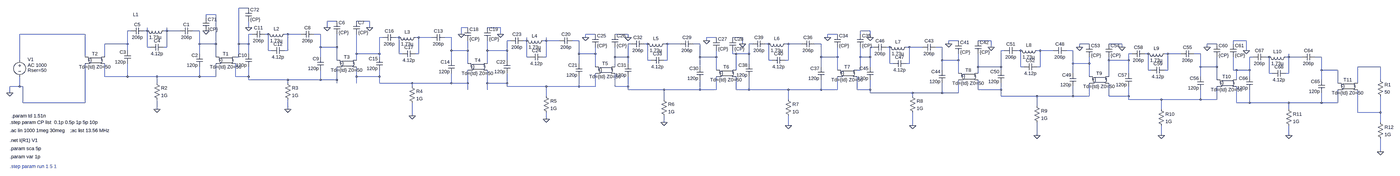
[diagram p0: schematic bridge_CPgroundcable.asc, whole sheet]
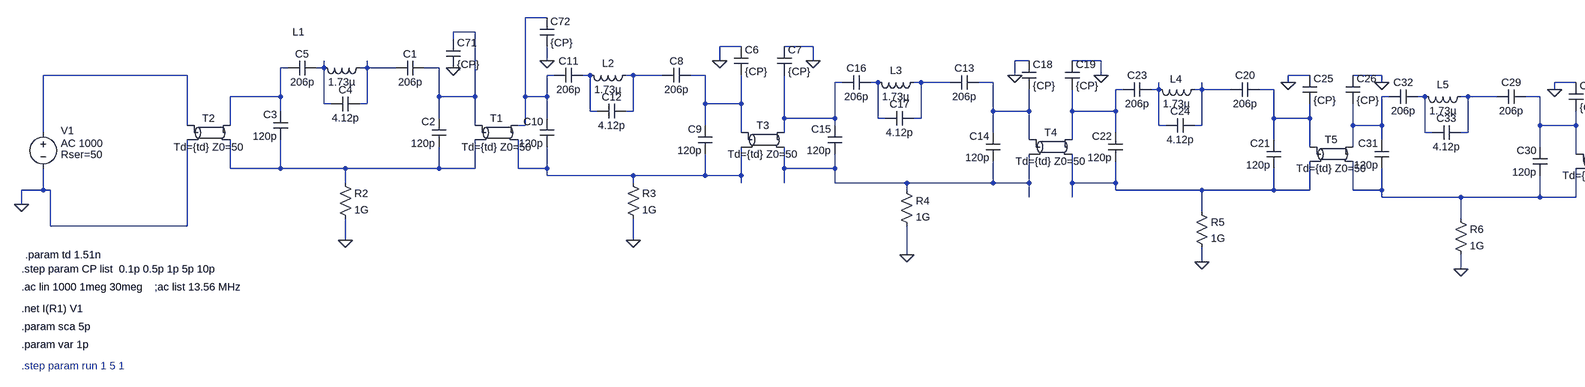
[diagram p1: schematic bridge_CPgroundcable.asc, part, row 1 of 1, column 1 of 2]
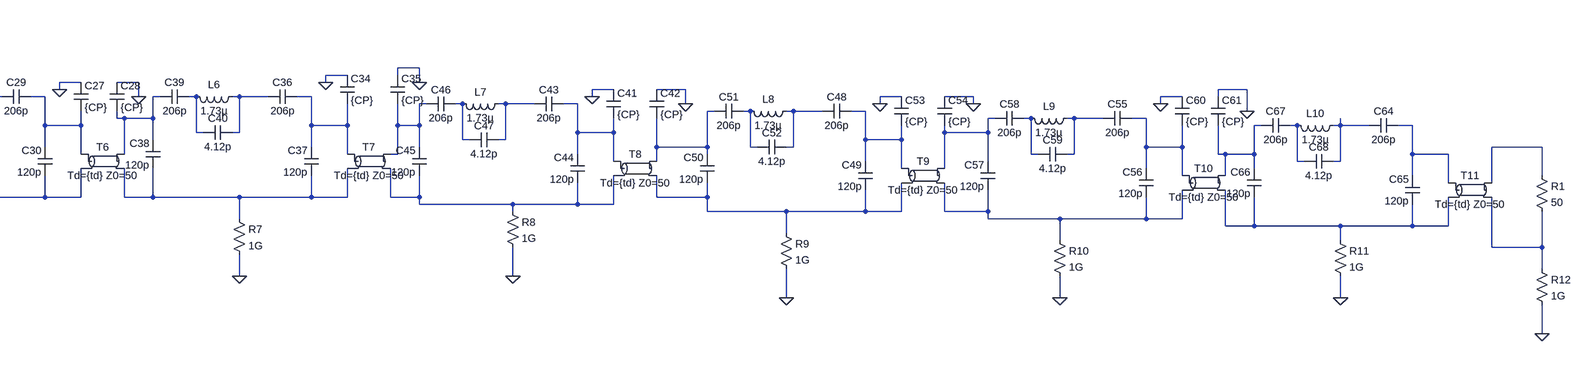
[diagram p2: schematic bridge_CPgroundcable.asc, part, row 1 of 1, column 2 of 2]
bridge_CPgroundcable.asc, the LTspice schematic file:
Version 4
SHEET 1 1680 680
WIRE -8640 -416 -8688 -416
WIRE -8800 -384 -8848 -384
WIRE -8848 -368 -8848 -384
WIRE -8208 -352 -8256 -352
WIRE -8048 -352 -8112 -352
WIRE -8640 -320 -8640 -352
WIRE -8256 -320 -8256 -352
WIRE -8048 -320 -8048 -352
WIRE -7568 -320 -7600 -320
WIRE -7408 -320 -7472 -320
WIRE -9216 -304 -9232 -304
WIRE -9136 -304 -9136 -320
WIRE -9136 -304 -9152 -304
WIRE -9040 -304 -9040 -320
WIRE -9040 -304 -9056 -304
WIRE -8976 -304 -9040 -304
WIRE -8880 -304 -8912 -304
WIRE -5600 -304 -5648 -304
WIRE -9440 -288 -9760 -288
WIRE -8624 -288 -8640 -288
WIRE -8544 -288 -8560 -288
WIRE -8448 -288 -8464 -288
WIRE -8384 -288 -8448 -288
WIRE -8288 -288 -8320 -288
WIRE -7600 -288 -7600 -320
WIRE -7408 -288 -7408 -320
WIRE -6944 -288 -6992 -288
WIRE -6784 -288 -6848 -288
WIRE -5760 -288 -5808 -288
WIRE -5648 -288 -5648 -304
WIRE -7984 -272 -8000 -272
WIRE -7904 -272 -7920 -272
WIRE -7808 -272 -7824 -272
WIRE -7744 -272 -7808 -272
WIRE -7648 -272 -7680 -272
WIRE -6992 -272 -6992 -288
WIRE -6784 -272 -6784 -288
WIRE -6352 -272 -6400 -272
WIRE -6224 -272 -6272 -272
WIRE -5808 -272 -5808 -288
WIRE -5600 -272 -5600 -304
WIRE -7360 -256 -7376 -256
WIRE -7280 -256 -7280 -272
WIRE -7280 -256 -7296 -256
WIRE -7184 -256 -7184 -272
WIRE -7184 -256 -7200 -256
WIRE -7120 -256 -7184 -256
WIRE -7024 -256 -7056 -256
WIRE -6400 -256 -6400 -272
WIRE -5168 -256 -5216 -256
WIRE -5008 -256 -5072 -256
WIRE -3760 -256 -3824 -256
WIRE -9232 -240 -9232 -304
WIRE -9232 -240 -9344 -240
WIRE -8880 -240 -8880 -304
WIRE -8800 -240 -8800 -384
WIRE -8800 -240 -8880 -240
WIRE -8688 -240 -8688 -416
WIRE -8640 -240 -8640 -288
WIRE -8640 -240 -8688 -240
WIRE -6768 -240 -6784 -240
WIRE -6688 -240 -6704 -240
WIRE -6592 -240 -6608 -240
WIRE -6528 -240 -6592 -240
WIRE -6432 -240 -6464 -240
WIRE -6224 -240 -6224 -272
WIRE -6176 -240 -6192 -240
WIRE -6096 -240 -6112 -240
WIRE -6000 -240 -6016 -240
WIRE -5936 -240 -6000 -240
WIRE -5840 -240 -5872 -240
WIRE -5216 -240 -5216 -256
WIRE -4528 -240 -4576 -240
WIRE -4368 -240 -4432 -240
WIRE -3904 -240 -3952 -240
WIRE -3824 -240 -3824 -256
WIRE -9136 -224 -9136 -304
WIRE -9120 -224 -9136 -224
WIRE -9040 -224 -9040 -304
WIRE -9040 -224 -9056 -224
WIRE -8288 -224 -8288 -288
WIRE -8208 -224 -8208 -288
WIRE -8208 -224 -8288 -224
WIRE -5584 -224 -5600 -224
WIRE -5504 -224 -5520 -224
WIRE -5408 -224 -5424 -224
WIRE -5344 -224 -5408 -224
WIRE -5248 -224 -5280 -224
WIRE -5008 -224 -5008 -256
WIRE -4576 -224 -4576 -240
WIRE -4368 -224 -4368 -240
WIRE -3952 -224 -3952 -240
WIRE -9232 -208 -9232 -240
WIRE -8544 -208 -8544 -288
WIRE -8528 -208 -8544 -208
WIRE -8448 -208 -8448 -288
WIRE -8448 -208 -8464 -208
WIRE -7648 -208 -7648 -272
WIRE -7568 -208 -7568 -256
WIRE -7568 -208 -7648 -208
WIRE -7472 -208 -7472 -256
WIRE -7376 -208 -7376 -256
WIRE -7376 -208 -7472 -208
WIRE -4944 -208 -4960 -208
WIRE -4864 -208 -4880 -208
WIRE -4768 -208 -4784 -208
WIRE -4704 -208 -4768 -208
WIRE -4608 -208 -4640 -208
WIRE -3760 -208 -3760 -256
WIRE -8880 -192 -8880 -240
WIRE -8640 -192 -8640 -240
WIRE -8112 -192 -8112 -288
WIRE -8000 -192 -8000 -272
WIRE -8000 -192 -8112 -192
WIRE -7904 -192 -7904 -272
WIRE -7888 -192 -7904 -192
WIRE -7808 -192 -7808 -272
WIRE -7808 -192 -7824 -192
WIRE -7024 -192 -7024 -256
WIRE -6944 -192 -6944 -224
WIRE -6944 -192 -7024 -192
WIRE -6272 -192 -6272 -208
WIRE -6256 -192 -6272 -192
WIRE -6192 -192 -6192 -240
WIRE -6192 -192 -6256 -192
WIRE -4320 -192 -4336 -192
WIRE -4240 -192 -4256 -192
WIRE -4144 -192 -4160 -192
WIRE -4080 -192 -4144 -192
WIRE -3984 -192 -4016 -192
WIRE -9440 -176 -9440 -288
WIRE -9344 -176 -9344 -240
WIRE -8800 -176 -8800 -240
WIRE -8688 -176 -8688 -240
WIRE -8688 -176 -8704 -176
WIRE -8288 -176 -8288 -224
WIRE -8000 -176 -8000 -192
WIRE -7280 -176 -7280 -256
WIRE -7264 -176 -7280 -176
WIRE -7184 -176 -7184 -256
WIRE -7184 -176 -7200 -176
WIRE -6848 -176 -6848 -224
WIRE -6784 -176 -6784 -240
WIRE -6784 -176 -6848 -176
WIRE -6432 -176 -6432 -240
WIRE -6352 -176 -6352 -208
WIRE -6352 -176 -6432 -176
WIRE -5840 -176 -5840 -240
WIRE -5760 -176 -5760 -224
WIRE -5760 -176 -5840 -176
WIRE -5648 -176 -5648 -224
WIRE -5600 -176 -5600 -224
WIRE -5600 -176 -5648 -176
WIRE -3728 -176 -3744 -176
WIRE -3648 -176 -3664 -176
WIRE -3552 -176 -3552 -192
WIRE -3552 -176 -3568 -176
WIRE -3488 -176 -3552 -176
WIRE -3392 -176 -3424 -176
WIRE -9760 -160 -9760 -288
WIRE -8208 -160 -8208 -224
WIRE -8112 -160 -8112 -192
WIRE -7648 -160 -7648 -208
WIRE -7376 -160 -7376 -208
WIRE -6688 -160 -6688 -240
WIRE -6672 -160 -6688 -160
WIRE -6592 -160 -6592 -240
WIRE -6592 -160 -6608 -160
WIRE -6096 -160 -6096 -240
WIRE -6080 -160 -6096 -160
WIRE -6000 -160 -6000 -240
WIRE -6000 -160 -6016 -160
WIRE -5248 -160 -5248 -224
WIRE -5168 -160 -5168 -192
WIRE -5168 -160 -5248 -160
WIRE -4432 -160 -4432 -176
WIRE -4336 -160 -4336 -192
WIRE -4336 -160 -4432 -160
WIRE -7568 -144 -7568 -208
WIRE -7472 -144 -7472 -208
WIRE -7024 -144 -7024 -192
WIRE -6784 -144 -6784 -176
WIRE -6192 -144 -6192 -192
WIRE -5504 -144 -5504 -224
WIRE -5488 -144 -5504 -144
WIRE -5408 -144 -5408 -224
WIRE -5408 -144 -5424 -144
WIRE -4608 -144 -4608 -208
WIRE -4528 -144 -4528 -176
WIRE -4528 -144 -4608 -144
WIRE -6944 -128 -6944 -192
WIRE -6848 -128 -6848 -176
WIRE -6432 -128 -6432 -176
WIRE -5840 -128 -5840 -176
WIRE -5600 -128 -5600 -176
WIRE -5072 -128 -5072 -192
WIRE -4960 -128 -4960 -208
WIRE -4960 -128 -5072 -128
WIRE -4864 -128 -4864 -208
WIRE -4848 -128 -4864 -128
WIRE -4768 -128 -4768 -208
WIRE -4768 -128 -4784 -128
WIRE -3984 -128 -3984 -192
WIRE -3904 -128 -3904 -176
WIRE -3904 -128 -3984 -128
WIRE -3104 -128 -3216 -128
WIRE -6352 -112 -6352 -176
WIRE -6256 -112 -6256 -192
WIRE -5760 -112 -5760 -176
WIRE -5648 -112 -5648 -176
WIRE -5648 -112 -5664 -112
WIRE -5248 -112 -5248 -160
WIRE -4960 -112 -4960 -128
WIRE -4240 -112 -4240 -192
WIRE -4224 -112 -4240 -112
WIRE -4144 -112 -4144 -192
WIRE -4144 -112 -4160 -112
WIRE -3824 -112 -3824 -176
WIRE -3808 -112 -3824 -112
WIRE -3744 -112 -3744 -176
WIRE -3744 -112 -3808 -112
WIRE -3392 -112 -3392 -176
WIRE -3312 -112 -3392 -112
WIRE -5168 -96 -5168 -160
WIRE -5072 -96 -5072 -128
WIRE -4608 -96 -4608 -144
WIRE -4336 -96 -4336 -160
WIRE -3648 -96 -3648 -176
WIRE -3632 -96 -3648 -96
WIRE -3552 -96 -3552 -176
WIRE -3552 -96 -3568 -96
WIRE -9344 -80 -9344 -144
WIRE -9232 -80 -9232 -144
WIRE -9232 -80 -9344 -80
WIRE -9088 -80 -9232 -80
WIRE -8880 -80 -8880 -128
WIRE -8880 -80 -9088 -80
WIRE -8800 -80 -8800 -144
WIRE -8800 -80 -8880 -80
WIRE -8704 -80 -8704 -144
WIRE -8640 -80 -8640 -128
WIRE -8640 -80 -8704 -80
WIRE -8112 -80 -8112 -128
WIRE -8000 -80 -8000 -112
WIRE -8000 -80 -8112 -80
WIRE -4528 -80 -4528 -144
WIRE -4432 -80 -4432 -160
WIRE -3984 -80 -3984 -128
WIRE -3744 -80 -3744 -112
WIRE -8640 -64 -8640 -80
WIRE -8448 -64 -8640 -64
WIRE -8288 -64 -8288 -112
WIRE -8288 -64 -8448 -64
WIRE -8208 -64 -8208 -128
WIRE -8208 -64 -8288 -64
WIRE -3904 -64 -3904 -128
WIRE -3808 -64 -3808 -112
WIRE -3392 -64 -3392 -112
WIRE -3104 -64 -3104 -128
WIRE -9088 -48 -9088 -80
WIRE -8448 -48 -8448 -64
WIRE -8208 -48 -8208 -64
WIRE -8112 -48 -8112 -80
WIRE -8000 -48 -8000 -80
WIRE -7840 -48 -8000 -48
WIRE -7648 -48 -7648 -96
WIRE -7648 -48 -7840 -48
WIRE -7568 -48 -7568 -112
WIRE -7568 -48 -7648 -48
WIRE -7472 -48 -7472 -112
WIRE -7376 -48 -7376 -96
WIRE -7376 -48 -7472 -48
WIRE -3312 -48 -3312 -112
WIRE -3216 -48 -3216 -128
WIRE -9760 -32 -9760 -80
WIRE -9760 -32 -9808 -32
WIRE -9744 -32 -9760 -32
WIRE -7840 -32 -7840 -48
WIRE -7376 -32 -7376 -48
WIRE -7184 -32 -7376 -32
WIRE -7024 -32 -7024 -80
WIRE -7024 -32 -7184 -32
WIRE -6944 -32 -6944 -96
WIRE -6944 -32 -7024 -32
WIRE -6848 -32 -6848 -96
WIRE -6784 -32 -6784 -80
WIRE -6784 -32 -6848 -32
WIRE -7568 -16 -7568 -48
WIRE -7472 -16 -7472 -48
WIRE -6784 -16 -6784 -32
WIRE -6608 -16 -6784 -16
WIRE -6432 -16 -6432 -64
WIRE -6432 -16 -6608 -16
WIRE -6352 -16 -6352 -80
WIRE -6352 -16 -6432 -16
WIRE -6256 -16 -6256 -80
WIRE -6192 -16 -6192 -80
WIRE -6192 -16 -6256 -16
WIRE -6000 -16 -6192 -16
WIRE -5840 -16 -5840 -64
WIRE -5840 -16 -6000 -16
WIRE -5760 -16 -5760 -80
WIRE -5760 -16 -5840 -16
WIRE -5664 -16 -5664 -80
WIRE -5600 -16 -5600 -64
WIRE -5600 -16 -5664 -16
WIRE -5072 -16 -5072 -64
WIRE -4960 -16 -4960 -48
WIRE -4960 -16 -5072 -16
WIRE -9808 0 -9808 -32
WIRE -5600 0 -5600 -16
WIRE -5392 0 -5600 0
WIRE -5248 0 -5248 -48
WIRE -5248 0 -5392 0
WIRE -5168 0 -5168 -64
WIRE -5168 0 -5248 0
WIRE -7184 16 -7184 -32
WIRE -5392 16 -5392 0
WIRE -4960 16 -4960 -16
WIRE -4784 16 -4960 16
WIRE -4608 16 -4608 -32
WIRE -4608 16 -4784 16
WIRE -4528 16 -4528 -48
WIRE -4528 16 -4608 16
WIRE -4432 16 -4432 -48
WIRE -4336 16 -4336 -32
WIRE -4336 16 -4432 16
WIRE -6608 32 -6608 -16
WIRE -6000 32 -6000 -16
WIRE -4336 32 -4336 16
WIRE -4176 32 -4336 32
WIRE -3984 32 -3984 -16
WIRE -3984 32 -4176 32
WIRE -3904 32 -3904 -32
WIRE -3904 32 -3984 32
WIRE -9744 48 -9744 -32
WIRE -9440 48 -9440 -144
WIRE -9440 48 -9744 48
WIRE -3808 48 -3808 -32
WIRE -3744 48 -3744 -16
WIRE -3744 48 -3808 48
WIRE -3552 48 -3744 48
WIRE -3392 48 -3392 0
WIRE -3392 48 -3552 48
WIRE -3312 48 -3312 -16
WIRE -3312 48 -3392 48
WIRE -4784 64 -4784 16
WIRE -9088 80 -9088 32
WIRE -8448 80 -8448 32
WIRE -4176 80 -4176 32
WIRE -3552 80 -3552 48
WIRE -3216 96 -3216 -16
WIRE -3104 96 -3104 16
WIRE -3104 96 -3216 96
WIRE -7840 112 -7840 48
WIRE -7184 128 -7184 96
WIRE -6608 144 -6608 112
WIRE -3104 144 -3104 96
WIRE -6000 160 -6000 112
WIRE -5392 160 -5392 96
WIRE -4784 208 -4784 144
WIRE -4176 208 -4176 160
WIRE -3552 208 -3552 160
WIRE -3104 288 -3104 224
FLAG -9808 0 0
FLAG -3104 288 0
FLAG -8848 -304 0
FLAG -8640 -320 0
FLAG -8256 -320 0
FLAG -8048 -320 0
FLAG -6400 -256 0
FLAG -6224 -240 0
FLAG -5808 -272 0
FLAG -5600 -272 0
FLAG -5216 -240 0
FLAG -5008 -224 0
FLAG -4576 -224 0
FLAG -4368 -224 0
FLAG -3952 -224 0
FLAG -3760 -208 0
FLAG -7600 -288 0
FLAG -7408 -288 0
FLAG -6992 -272 0
FLAG -6784 -272 0
FLAG -3552 208 0
FLAG -4176 208 0
FLAG -4784 208 0
FLAG -5392 160 0
FLAG -6000 160 0
FLAG -6608 144 0
FLAG -7184 128 0
FLAG -7840 112 0
FLAG -8448 80 0
FLAG -9088 80 0
SYMBOL voltage -9760 -176 R0
WINDOW 0 39 12 Left 2
WINDOW 123 39 40 Left 2
WINDOW 39 39 65 Left 2
SYMATTR InstName V1
SYMATTR Value2 AC 1000
SYMATTR SpiceLine Rser=50
SYMATTR Value ""
SYMBOL res -3120 -80 R0
SYMATTR InstName R1
SYMATTR Value 50
SYMBOL tline -8752 -160 R0
SYMATTR InstName T1
SYMATTR Value Td={td} Z0=50
SYMBOL tline -9392 -160 R0
SYMATTR InstName T2
SYMATTR Value Td={td} Z0=50
SYMBOL cap -8912 -320 R90
WINDOW 0 0 32 VBottom 2
WINDOW 3 32 32 VTop 2
SYMATTR InstName C1
SYMATTR Value 206p
SYMBOL cap -8864 -128 R180
WINDOW 0 24 56 Left 2
WINDOW 3 24 8 Left 2
SYMATTR InstName C2
SYMATTR Value 120p
SYMBOL cap -9216 -144 R180
WINDOW 0 24 56 Left 2
WINDOW 3 24 8 Left 2
SYMATTR InstName C3
SYMATTR Value 120p
SYMBOL ind -9040 -320 R90
WINDOW 0 -49 152 VBottom 2
WINDOW 3 32 56 VTop 2
SYMATTR InstName L1
SYMATTR Value 1.73µ
SYMBOL cap -9152 -320 R90
WINDOW 0 0 32 VBottom 2
WINDOW 3 32 32 VTop 2
SYMATTR InstName C5
SYMATTR Value 206p
SYMBOL cap -9056 -240 R90
WINDOW 0 0 32 VBottom 2
WINDOW 3 32 32 VTop 2
SYMATTR InstName C4
SYMATTR Value 4.12p
SYMBOL tline -8160 -144 R0
SYMATTR InstName T3
SYMATTR Value Td={td} Z0=50
SYMBOL cap -8320 -304 R90
WINDOW 0 0 32 VBottom 2
WINDOW 3 32 32 VTop 2
SYMATTR InstName C8
SYMATTR Value 206p
SYMBOL cap -8272 -112 R180
WINDOW 0 24 56 Left 2
WINDOW 3 24 8 Left 2
SYMATTR InstName C9
SYMATTR Value 120p
SYMBOL cap -8624 -128 R180
WINDOW 0 24 56 Left 2
WINDOW 3 24 8 Left 2
SYMATTR InstName C10
SYMATTR Value 120p
SYMBOL ind -8448 -304 R90
WINDOW 0 5 56 VBottom 2
WINDOW 3 32 56 VTop 2
SYMATTR InstName L2
SYMATTR Value 1.73µ
SYMBOL cap -8560 -304 R90
WINDOW 0 0 32 VBottom 2
WINDOW 3 32 32 VTop 2
SYMATTR InstName C11
SYMATTR Value 206p
SYMBOL cap -8464 -224 R90
WINDOW 0 0 32 VBottom 2
WINDOW 3 32 32 VTop 2
SYMATTR InstName C12
SYMATTR Value 4.12p
SYMBOL tline -7520 -128 R0
SYMATTR InstName T4
SYMATTR Value Td={td} Z0=50
SYMBOL cap -7680 -288 R90
WINDOW 0 0 32 VBottom 2
WINDOW 3 32 32 VTop 2
SYMATTR InstName C13
SYMATTR Value 206p
SYMBOL cap -7632 -96 R180
WINDOW 0 24 56 Left 2
WINDOW 3 24 8 Left 2
SYMATTR InstName C14
SYMATTR Value 120p
SYMBOL cap -7984 -112 R180
WINDOW 0 24 56 Left 2
WINDOW 3 24 8 Left 2
SYMATTR InstName C15
SYMATTR Value 120p
SYMBOL ind -7808 -288 R90
WINDOW 0 5 56 VBottom 2
WINDOW 3 32 56 VTop 2
SYMATTR InstName L3
SYMATTR Value 1.73µ
SYMBOL cap -7920 -288 R90
WINDOW 0 0 32 VBottom 2
WINDOW 3 32 32 VTop 2
SYMATTR InstName C16
SYMATTR Value 206p
SYMBOL cap -7824 -208 R90
WINDOW 0 0 32 VBottom 2
WINDOW 3 32 32 VTop 2
SYMATTR InstName C17
SYMATTR Value 4.12p
SYMBOL tline -6896 -112 R0
SYMATTR InstName T5
SYMATTR Value Td={td} Z0=50
SYMBOL cap -7056 -272 R90
WINDOW 0 0 32 VBottom 2
WINDOW 3 32 32 VTop 2
SYMATTR InstName C20
SYMATTR Value 206p
SYMBOL cap -7008 -80 R180
WINDOW 0 24 56 Left 2
WINDOW 3 24 8 Left 2
SYMATTR InstName C21
SYMATTR Value 120p
SYMBOL cap -7360 -96 R180
WINDOW 0 24 56 Left 2
WINDOW 3 24 8 Left 2
SYMATTR InstName C22
SYMATTR Value 120p
SYMBOL ind -7184 -272 R90
WINDOW 0 8 57 VBottom 2
WINDOW 3 32 56 VTop 2
SYMATTR InstName L4
SYMATTR Value 1.73µ
SYMBOL cap -7296 -272 R90
WINDOW 0 0 32 VBottom 2
WINDOW 3 32 32 VTop 2
SYMATTR InstName C23
SYMATTR Value 206p
SYMBOL cap -7200 -192 R90
WINDOW 0 0 32 VBottom 2
WINDOW 3 32 32 VTop 2
SYMATTR InstName C24
SYMATTR Value 4.12p
SYMBOL tline -6304 -96 R0
SYMATTR InstName T6
SYMATTR Value Td={td} Z0=50
SYMBOL cap -6464 -256 R90
WINDOW 0 0 32 VBottom 2
WINDOW 3 32 32 VTop 2
SYMATTR InstName C29
SYMATTR Value 206p
SYMBOL cap -6416 -64 R180
WINDOW 0 24 56 Left 2
WINDOW 3 24 8 Left 2
SYMATTR InstName C30
SYMATTR Value 120p
SYMBOL cap -6768 -80 R180
WINDOW 0 24 56 Left 2
WINDOW 3 24 8 Left 2
SYMATTR InstName C31
SYMATTR Value 120p
SYMBOL ind -6592 -256 R90
WINDOW 0 5 56 VBottom 2
WINDOW 3 32 56 VTop 2
SYMATTR InstName L5
SYMATTR Value 1.73µ
SYMBOL cap -6704 -256 R90
WINDOW 0 0 32 VBottom 2
WINDOW 3 32 32 VTop 2
SYMATTR InstName C32
SYMATTR Value 206p
SYMBOL cap -6608 -176 R90
WINDOW 0 0 32 VBottom 2
WINDOW 3 32 32 VTop 2
SYMATTR InstName C33
SYMATTR Value 4.12p
SYMBOL tline -5712 -96 R0
SYMATTR InstName T7
SYMATTR Value Td={td} Z0=50
SYMBOL cap -5872 -256 R90
WINDOW 0 0 32 VBottom 2
WINDOW 3 32 32 VTop 2
SYMATTR InstName C36
SYMATTR Value 206p
SYMBOL cap -5824 -64 R180
WINDOW 0 24 56 Left 2
WINDOW 3 24 8 Left 2
SYMATTR InstName C37
SYMATTR Value 120p
SYMBOL cap -6176 -80 R180
WINDOW 0 24 56 Left 2
WINDOW 3 24 8 Left 2
SYMATTR InstName C38
SYMATTR Value 120p
SYMBOL ind -6000 -256 R90
WINDOW 0 5 56 VBottom 2
WINDOW 3 32 56 VTop 2
SYMATTR InstName L6
SYMATTR Value 1.73µ
SYMBOL cap -6112 -256 R90
WINDOW 0 0 32 VBottom 2
WINDOW 3 32 32 VTop 2
SYMATTR InstName C39
SYMATTR Value 206p
SYMBOL cap -6016 -176 R90
WINDOW 0 0 32 VBottom 2
WINDOW 3 32 32 VTop 2
SYMATTR InstName C40
SYMATTR Value 4.12p
SYMBOL tline -5120 -80 R0
SYMATTR InstName T8
SYMATTR Value Td={td} Z0=50
SYMBOL cap -5280 -240 R90
WINDOW 0 0 32 VBottom 2
WINDOW 3 32 32 VTop 2
SYMATTR InstName C43
SYMATTR Value 206p
SYMBOL cap -5232 -48 R180
WINDOW 0 24 56 Left 2
WINDOW 3 24 8 Left 2
SYMATTR InstName C44
SYMATTR Value 120p
SYMBOL cap -5584 -64 R180
WINDOW 0 24 56 Left 2
WINDOW 3 24 8 Left 2
SYMATTR InstName C45
SYMATTR Value 120p
SYMBOL ind -5408 -240 R90
WINDOW 0 5 56 VBottom 2
WINDOW 3 32 56 VTop 2
SYMATTR InstName L7
SYMATTR Value 1.73µ
SYMBOL cap -5520 -240 R90
WINDOW 0 0 32 VBottom 2
WINDOW 3 32 32 VTop 2
SYMATTR InstName C46
SYMATTR Value 206p
SYMBOL cap -5424 -160 R90
WINDOW 0 0 32 VBottom 2
WINDOW 3 32 32 VTop 2
SYMATTR InstName C47
SYMATTR Value 4.12p
SYMBOL tline -4480 -64 R0
SYMATTR InstName T9
SYMATTR Value Td={td} Z0=50
SYMBOL cap -4640 -224 R90
WINDOW 0 0 32 VBottom 2
WINDOW 3 32 32 VTop 2
SYMATTR InstName C48
SYMATTR Value 206p
SYMBOL cap -4592 -32 R180
WINDOW 0 24 56 Left 2
WINDOW 3 24 8 Left 2
SYMATTR InstName C49
SYMATTR Value 120p
SYMBOL cap -4944 -48 R180
WINDOW 0 24 56 Left 2
WINDOW 3 24 8 Left 2
SYMATTR InstName C50
SYMATTR Value 120p
SYMBOL ind -4768 -224 R90
WINDOW 0 5 56 VBottom 2
WINDOW 3 32 56 VTop 2
SYMATTR InstName L8
SYMATTR Value 1.73µ
SYMBOL cap -4880 -224 R90
WINDOW 0 0 32 VBottom 2
WINDOW 3 32 32 VTop 2
SYMATTR InstName C51
SYMATTR Value 206p
SYMBOL cap -4784 -144 R90
WINDOW 0 0 32 VBottom 2
WINDOW 3 32 32 VTop 2
SYMATTR InstName C52
SYMATTR Value 4.12p
SYMBOL tline -3856 -48 R0
SYMATTR InstName T10
SYMATTR Value Td={td} Z0=50
SYMBOL cap -4016 -208 R90
WINDOW 0 0 32 VBottom 2
WINDOW 3 32 32 VTop 2
SYMATTR InstName C55
SYMATTR Value 206p
SYMBOL cap -3968 -16 R180
WINDOW 0 24 56 Left 2
WINDOW 3 24 8 Left 2
SYMATTR InstName C56
SYMATTR Value 120p
SYMBOL cap -4320 -32 R180
WINDOW 0 24 56 Left 2
WINDOW 3 24 8 Left 2
SYMATTR InstName C57
SYMATTR Value 120p
SYMBOL ind -4144 -208 R90
WINDOW 0 5 56 VBottom 2
WINDOW 3 32 56 VTop 2
SYMATTR InstName L9
SYMATTR Value 1.73µ
SYMBOL cap -4256 -208 R90
WINDOW 0 0 32 VBottom 2
WINDOW 3 32 32 VTop 2
SYMATTR InstName C58
SYMATTR Value 206p
SYMBOL cap -4160 -128 R90
WINDOW 0 0 32 VBottom 2
WINDOW 3 32 32 VTop 2
SYMATTR InstName C59
SYMATTR Value 4.12p
SYMBOL tline -3264 -32 R0
SYMATTR InstName T11
SYMATTR Value Td={td} Z0=50
SYMBOL cap -3424 -192 R90
WINDOW 0 0 32 VBottom 2
WINDOW 3 32 32 VTop 2
SYMATTR InstName C64
SYMATTR Value 206p
SYMBOL cap -3376 0 R180
WINDOW 0 24 56 Left 2
WINDOW 3 24 8 Left 2
SYMATTR InstName C65
SYMATTR Value 120p
SYMBOL cap -3728 -16 R180
WINDOW 0 24 56 Left 2
WINDOW 3 24 8 Left 2
SYMATTR InstName C66
SYMATTR Value 120p
SYMBOL ind -3552 -192 R90
WINDOW 0 5 56 VBottom 2
WINDOW 3 32 56 VTop 2
SYMATTR InstName L10
SYMATTR Value 1.73µ
SYMBOL cap -3664 -192 R90
WINDOW 0 0 32 VBottom 2
WINDOW 3 32 32 VTop 2
SYMATTR InstName C67
SYMATTR Value 206p
SYMBOL cap -3568 -112 R90
WINDOW 0 0 32 VBottom 2
WINDOW 3 32 32 VTop 2
SYMATTR InstName C68
SYMATTR Value 4.12p
SYMBOL res -3120 128 R0
SYMATTR InstName R12
SYMATTR Value 1G
SYMBOL cap -8864 -368 R0
SYMATTR InstName C71
SYMATTR Value {CP}
SYMBOL cap -8656 -416 R0
SYMATTR InstName C72
SYMATTR Value {CP}
SYMBOL cap -8224 -352 R0
SYMATTR InstName C6
SYMATTR Value {CP}
SYMBOL cap -8128 -352 R0
SYMATTR InstName C7
SYMATTR Value {CP}
SYMBOL cap -7584 -320 R0
SYMATTR InstName C18
SYMATTR Value {CP}
SYMBOL cap -7488 -320 R0
SYMATTR InstName C19
SYMATTR Value {CP}
SYMBOL cap -6960 -288 R0
SYMATTR InstName C25
SYMATTR Value {CP}
SYMBOL cap -6864 -288 R0
SYMATTR InstName C26
SYMATTR Value {CP}
SYMBOL cap -6368 -272 R0
SYMATTR InstName C27
SYMATTR Value {CP}
SYMBOL cap -6288 -272 R0
SYMATTR InstName C28
SYMATTR Value {CP}
SYMBOL cap -5776 -288 R0
SYMATTR InstName C34
SYMATTR Value {CP}
SYMBOL cap -5664 -288 R0
SYMATTR InstName C35
SYMATTR Value {CP}
SYMBOL cap -5184 -256 R0
SYMATTR InstName C41
SYMATTR Value {CP}
SYMBOL cap -5088 -256 R0
SYMATTR InstName C42
SYMATTR Value {CP}
SYMBOL cap -4544 -240 R0
SYMATTR InstName C53
SYMATTR Value {CP}
SYMBOL cap -4448 -240 R0
SYMATTR InstName C54
SYMATTR Value {CP}
SYMBOL cap -3920 -240 R0
SYMATTR InstName C60
SYMATTR Value {CP}
SYMBOL cap -3840 -240 R0
SYMATTR InstName C61
SYMATTR Value {CP}
SYMBOL res -9104 -64 R0
SYMATTR InstName R2
SYMATTR Value 1G
SYMBOL res -8464 -64 R0
SYMATTR InstName R3
SYMATTR Value 1G
SYMBOL res -7856 -48 R0
SYMATTR InstName R4
SYMATTR Value 1G
SYMBOL res -7200 0 R0
SYMATTR InstName R5
SYMATTR Value 1G
SYMBOL res -6624 16 R0
SYMATTR InstName R6
SYMATTR Value 1G
SYMBOL res -6016 16 R0
SYMATTR InstName R7
SYMATTR Value 1G
SYMBOL res -5408 0 R0
SYMATTR InstName R8
SYMATTR Value 1G
SYMBOL res -4800 48 R0
SYMATTR InstName R9
SYMATTR Value 1G
SYMBOL res -4192 64 R0
SYMATTR InstName R10
SYMATTR Value 1G
SYMBOL res -3568 64 R0
SYMATTR InstName R11
SYMATTR Value 1G
TEXT -9808 184 Left 2 !.ac lin 1000 1meg 30meg
TEXT -9808 232 Left 2 !.net I(R1) V1
TEXT -9808 144 Left 2 !.step param CP list  0.1p 0.5p 1p 5p 10p
TEXT -9800 112 Left 2 !.param td 1.51n
TEXT -9808 272 Left 2 !.param sca 5p
TEXT -9808 312 Left 2 !.param var 1p
TEXT -9808 360 Left 2 ;.step param run 1 5 1
TEXT -9512 184 Left 2 !;ac list 13.56 MHz

The netlist it stands for:
* bridge_CPgroundcable.asc
V1 N006 0 AC 1000 Rser=50
R1 N042 N053 50
T1 N002 N043 N001 N044 Td={td} Z0=50
T2 N006 0 N003 N043 Td={td} Z0=50
C1 N002 N005 206p
C2 N043 N002 120p
C3 N043 N003 120p
L1 N005 N004 1.73µ
C5 N004 N003 206p
C4 N005 N004 4.12p
T3 N009 N044 N010 N045 Td={td} Z0=50
C8 N009 N008 206p
C9 N044 N009 120p
C10 N044 N001 120p
L2 N008 N007 1.73µ
C11 N007 N001 206p
C12 N008 N007 4.12p
T4 N013 N045 N014 N046 Td={td} Z0=50
C13 N013 N012 206p
C14 N045 N013 120p
C15 N045 N010 120p
L3 N012 N011 1.73µ
C16 N011 N010 206p
C17 N012 N011 4.12p
T5 N017 N046 N018 N047 Td={td} Z0=50
C20 N017 N016 206p
C21 N046 N017 120p
C22 N046 N014 120p
L4 N016 N015 1.73µ
C23 N015 N014 206p
C24 N016 N015 4.12p
T6 N021 N047 N022 N048 Td={td} Z0=50
C29 N021 N020 206p
C30 N047 N021 120p
C31 N047 N018 120p
L5 N020 N019 1.73µ
C32 N019 N018 206p
C33 N020 N019 4.12p
T7 N025 N048 N026 N049 Td={td} Z0=50
C36 N025 N024 206p
C37 N048 N025 120p
C38 N048 N022 120p
L6 N024 N023 1.73µ
C39 N023 N022 206p
C40 N024 N023 4.12p
T8 N029 N049 N030 N050 Td={td} Z0=50
C43 N029 N028 206p
C44 N049 N029 120p
C45 N049 N026 120p
L7 N028 N027 1.73µ
C46 N027 N026 206p
C47 N028 N027 4.12p
T9 N033 N050 N034 N051 Td={td} Z0=50
C48 N033 N032 206p
C49 N050 N033 120p
C50 N050 N030 120p
L8 N032 N031 1.73µ
C51 N031 N030 206p
C52 N032 N031 4.12p
T10 N037 N051 N038 N052 Td={td} Z0=50
C55 N037 N036 206p
C56 N051 N037 120p
C57 N051 N034 120p
L9 N036 N035 1.73µ
C58 N035 N034 206p
C59 N036 N035 4.12p
T11 N041 N052 N042 N053 Td={td} Z0=50
C64 N041 N040 206p
C65 N052 N041 120p
C66 N052 N038 120p
L10 N040 N039 1.73µ
C67 N039 N038 206p
C68 N040 N039 4.12p
R12 N053 0 1G
C71 N002 0 {CP}
C72 N001 0 {CP}
C6 0 N009 {CP}
C7 0 N010 {CP}
C18 0 N013 {CP}
C19 0 N014 {CP}
C25 0 N017 {CP}
C26 0 N018 {CP}
C27 0 N021 {CP}
C28 0 N022 {CP}
C34 0 N025 {CP}
C35 0 N026 {CP}
C41 0 N029 {CP}
C42 0 N030 {CP}
C53 0 N033 {CP}
C54 0 N034 {CP}
C60 0 N037 {CP}
C61 0 N038 {CP}
R2 N043 0 1G
R3 N044 0 1G
R4 N045 0 1G
R5 N046 0 1G
R6 N047 0 1G
R7 N048 0 1G
R8 N049 0 1G
R9 N050 0 1G
R10 N051 0 1G
R11 N052 0 1G
.ac lin 1000 1meg 30meg
.net I(R1) V1
.step param CP list  0.1p 0.5p 1p 5p 10p
.param td 1.51n
.param sca 5p
.param var 1p
* .step param run 1 5 1
;ac list 13.56 MHz
.backanno
.end